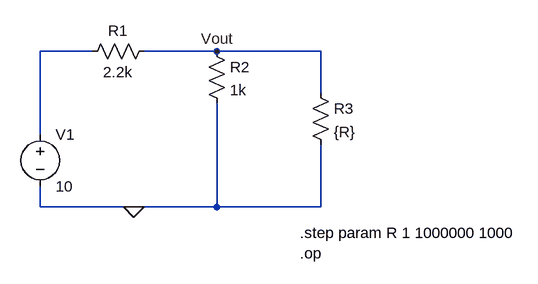
[diagram p0: schematic Draft1.asc]
Draft1.asc, the LTspice schematic file:
Version 4
SHEET 1 880 680
WIRE 80 -32 0 -32
WIRE 272 -32 160 -32
WIRE 432 -32 272 -32
WIRE 432 32 432 -32
WIRE 0 96 0 -32
WIRE 0 208 0 176
WIRE 144 208 0 208
WIRE 272 208 272 48
WIRE 272 208 144 208
WIRE 432 208 432 112
WIRE 432 208 272 208
FLAG 272 -32 Vout
FLAG 144 208 0
SYMBOL voltage 0 80 R0
WINDOW 123 0 0 Left 2
WINDOW 39 0 0 Left 2
SYMATTR InstName V1
SYMATTR Value 10
SYMBOL res 176 -48 R90
WINDOW 0 0 56 VBottom 2
WINDOW 3 32 56 VTop 2
SYMATTR InstName R1
SYMATTR Value 2.2k
SYMBOL res 256 -48 R0
SYMATTR InstName R2
SYMATTR Value 1k
SYMBOL res 416 16 R0
SYMATTR InstName R3
SYMATTR Value {R}
TEXT 400 248 Left 2 !.step param R 1 1000000 1000\n.op

The netlist it stands for:
* Draft1.asc
V1 N001 0 10
R1 Vout N001 2.2k
R2 Vout 0 1k
R3 Vout 0 {R}
.step param R 1 1000000 1000
.op
.backanno
.end